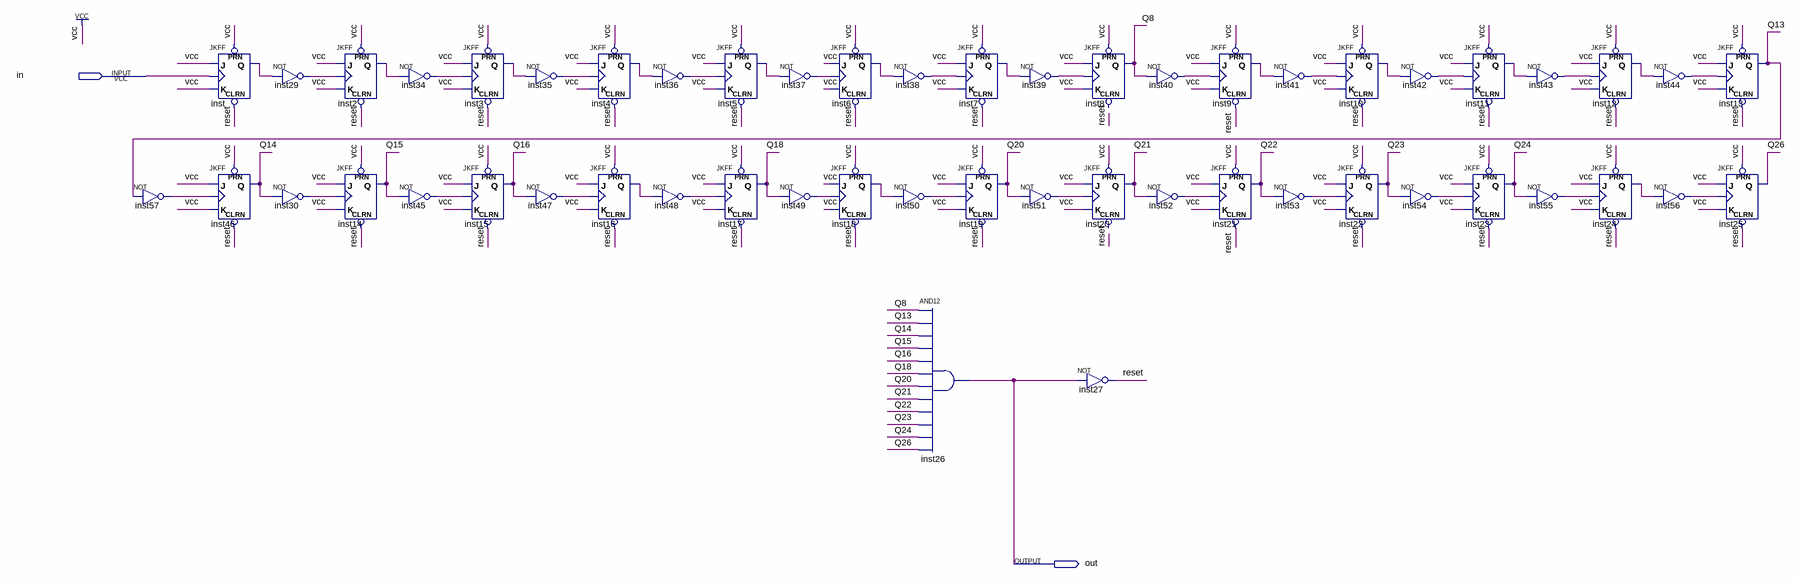
[diagram p0: schematic sheet]
// Quartus schematic frequency_divider.bdf as structural Verilog: 53 symbols, 2 pins
module frequency_divider (
  input  in,
  output out
);

  wire inst2_q, inst3_q, inst4_q, inst5_q, inst6_q, inst7_q, inst9_q, inst10_q, inst11_q, inst12_q, inst16_q,
       inst18_q, inst24_q, inst29_out, inst30_out, inst34_out, inst35_out, inst36_out, inst37_out,
       inst38_out, inst39_out, inst40_out, inst41_out, inst42_out, inst43_out, inst44_out, inst45_out,
       inst47_out, inst48_out, inst49_out, inst50_out, inst51_out, inst52_out, inst53_out, inst54_out,
       inst55_out, inst56_out, inst57_out, inst_q, Q8, Q13, Q14, Q15, Q16, Q18, Q20, Q21, Q22, Q23, Q24, Q26,
       reset;

  not inst57 (inst57_out, Q13);
  JKFF inst (.PRN(1'b1), .CLRN(reset), .K(1'b1), .J(1'b1), .CLK(in), .Q(inst_q));
  JKFF inst46 (.PRN(1'b1), .CLRN(reset), .K(1'b1), .J(1'b1), .CLK(inst57_out), .Q(Q14));
  not inst29 (inst29_out, inst_q);
  not inst30 (inst30_out, Q14);
  JKFF inst2 (.PRN(1'b1), .CLRN(reset), .K(1'b1), .J(1'b1), .CLK(inst29_out), .Q(inst2_q));
  JKFF inst14 (.PRN(1'b1), .CLRN(reset), .K(1'b1), .J(1'b1), .CLK(inst30_out), .Q(Q15));
  not inst34 (inst34_out, inst2_q);
  not inst45 (inst45_out, Q15);
  JKFF inst3 (.PRN(1'b1), .CLRN(reset), .K(1'b1), .J(1'b1), .CLK(inst34_out), .Q(inst3_q));
  JKFF inst15 (.PRN(1'b1), .CLRN(reset), .K(1'b1), .J(1'b1), .CLK(inst45_out), .Q(Q16));
  not inst35 (inst35_out, inst3_q);
  not inst47 (inst47_out, Q16);
  JKFF inst4 (.PRN(1'b1), .CLRN(reset), .K(1'b1), .J(1'b1), .CLK(inst35_out), .Q(inst4_q));
  JKFF inst16 (.PRN(1'b1), .CLRN(reset), .K(1'b1), .J(1'b1), .CLK(inst47_out), .Q(inst16_q));
  not inst36 (inst36_out, inst4_q);
  not inst48 (inst48_out, inst16_q);
  JKFF inst5 (.PRN(1'b1), .CLRN(reset), .K(1'b1), .J(1'b1), .CLK(inst36_out), .Q(inst5_q));
  JKFF inst17 (.PRN(1'b1), .CLRN(reset), .K(1'b1), .J(1'b1), .CLK(inst48_out), .Q(Q18));
  not inst37 (inst37_out, inst5_q);
  not inst49 (inst49_out, Q18);
  JKFF inst6 (.PRN(1'b1), .CLRN(reset), .K(1'b1), .J(1'b1), .CLK(inst37_out), .Q(inst6_q));
  JKFF inst18 (.PRN(1'b1), .CLRN(reset), .K(1'b1), .J(1'b1), .CLK(inst49_out), .Q(inst18_q));
  not inst38 (inst38_out, inst6_q);
  not inst50 (inst50_out, inst18_q);
  and inst26 (out, Q8, Q13, Q14, Q15, Q16, Q18, Q20, Q21, Q22, Q23, Q24, Q26);
  JKFF inst7 (.PRN(1'b1), .CLRN(reset), .K(1'b1), .J(1'b1), .CLK(inst38_out), .Q(inst7_q));
  JKFF inst19 (.PRN(1'b1), .CLRN(reset), .K(1'b1), .J(1'b1), .CLK(inst50_out), .Q(Q20));
  not inst39 (inst39_out, inst7_q);
  not inst51 (inst51_out, Q20);
  not inst27 (reset, out);
  JKFF inst8 (.PRN(1'b1), .K(1'b1), .J(1'b1), .CLK(inst39_out), .Q(Q8));  // open: CLRN
  JKFF inst20 (.PRN(1'b1), .K(1'b1), .J(1'b1), .CLK(inst51_out), .Q(Q21));  // open: CLRN
  not inst40 (inst40_out, Q8);
  not inst52 (inst52_out, Q21);
  JKFF inst9 (.PRN(1'b1), .CLRN(reset), .K(1'b1), .J(1'b1), .CLK(inst40_out), .Q(inst9_q));
  JKFF inst21 (.PRN(1'b1), .CLRN(reset), .K(1'b1), .J(1'b1), .CLK(inst52_out), .Q(Q22));
  not inst41 (inst41_out, inst9_q);
  not inst53 (inst53_out, Q22);
  JKFF inst10 (.PRN(1'b1), .CLRN(reset), .K(1'b1), .J(1'b1), .CLK(inst41_out), .Q(inst10_q));
  JKFF inst22 (.PRN(1'b1), .CLRN(reset), .K(1'b1), .J(1'b1), .CLK(inst53_out), .Q(Q23));
  not inst42 (inst42_out, inst10_q);
  not inst54 (inst54_out, Q23);
  JKFF inst11 (.PRN(1'b1), .CLRN(reset), .K(1'b1), .J(1'b1), .CLK(inst42_out), .Q(inst11_q));
  JKFF inst23 (.PRN(1'b1), .CLRN(reset), .K(1'b1), .J(1'b1), .CLK(inst54_out), .Q(Q24));
  not inst43 (inst43_out, inst11_q);
  not inst55 (inst55_out, Q24);
  JKFF inst12 (.PRN(1'b1), .CLRN(reset), .K(1'b1), .J(1'b1), .CLK(inst43_out), .Q(inst12_q));
  JKFF inst24 (.PRN(1'b1), .CLRN(reset), .K(1'b1), .J(1'b1), .CLK(inst55_out), .Q(inst24_q));
  not inst44 (inst44_out, inst12_q);
  not inst56 (inst56_out, inst24_q);
  JKFF inst13 (.PRN(1'b1), .CLRN(reset), .K(1'b1), .J(1'b1), .CLK(inst44_out), .Q(Q13));
  JKFF inst25 (.PRN(1'b1), .CLRN(reset), .K(1'b1), .J(1'b1), .CLK(inst56_out), .Q(Q26));
endmodule
